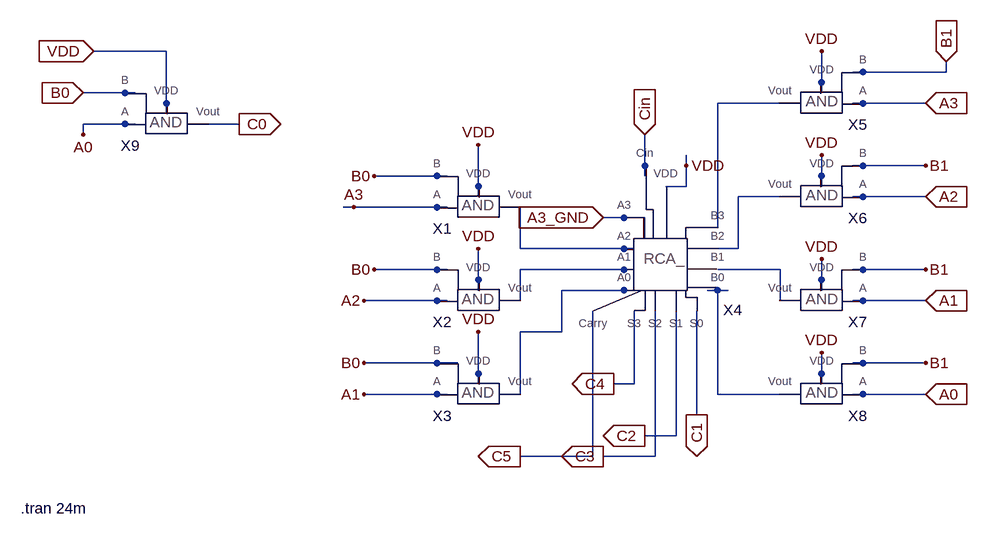
[diagram p0: schematic Mult_4_2.asc]
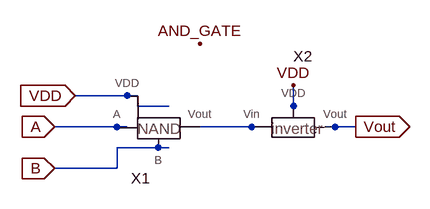
[diagram p1: sub-circuit and_gate.asc]
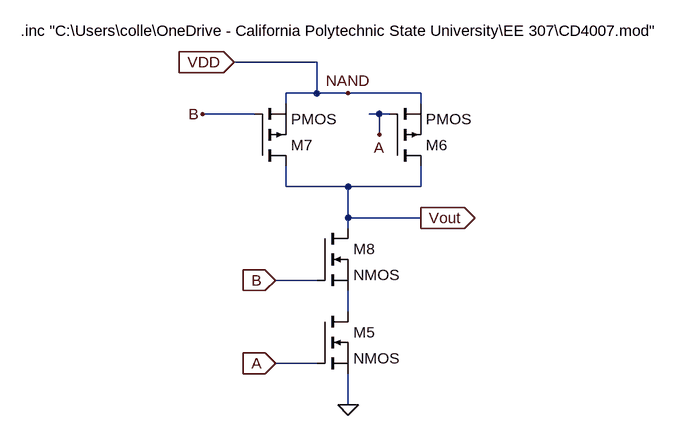
[diagram p2: sub-circuit nand_gate.asc]
Mult_4_2.asc, the LTspice schematic file:
Version 4
SHEET 1 880 680
WIRE -624 -192 -736 -192
WIRE 448 -160 432 -160
WIRE 576 -160 576 -176
WIRE 576 -160 448 -160
WIRE 384 -144 384 -192
WIRE -688 -128 -752 -128
WIRE -672 -128 -688 -128
WIRE 384 -128 384 -144
WIRE -624 -112 -624 -192
WIRE 320 -112 224 -112
WIRE 448 -112 432 -112
WIRE 544 -112 448 -112
WIRE -624 -96 -624 -112
WIRE -688 -80 -752 -80
WIRE -672 -80 -688 -80
WIRE -512 -80 -560 -80
WIRE -752 -64 -752 -80
WIRE 112 -16 112 -64
WIRE 176 -16 176 -32
WIRE 448 -16 432 -16
WIRE 544 -16 448 -16
WIRE -208 0 -304 0
WIRE -192 0 -208 0
WIRE 112 0 112 -16
WIRE 384 0 384 -32
WIRE -144 16 -144 -48
WIRE 176 16 176 -16
WIRE 176 16 144 16
WIRE 384 16 384 0
WIRE -144 32 -144 16
WIRE 320 32 256 32
WIRE 448 32 432 32
WIRE 544 32 448 32
WIRE -336 48 -352 48
WIRE -208 48 -336 48
WIRE -192 48 -208 48
WIRE 80 64 48 64
WIRE 112 64 80 64
WIRE 224 80 224 -112
WIRE 112 96 112 64
WIRE -80 112 -80 48
WIRE 80 112 -80 112
WIRE 96 112 80 112
WIRE 256 112 256 32
WIRE 256 112 224 112
WIRE -208 144 -304 144
WIRE -192 144 -208 144
WIRE 80 144 -80 144
WIRE 96 144 80 144
WIRE 320 144 224 144
WIRE 448 144 432 144
WIRE 544 144 448 144
WIRE -144 160 -144 112
WIRE 384 160 384 128
WIRE -144 176 -144 160
WIRE 80 176 -16 176
WIRE 96 176 80 176
WIRE 224 176 208 176
WIRE 240 176 224 176
WIRE 384 176 384 160
WIRE -208 192 -320 192
WIRE -192 192 -208 192
WIRE -80 192 -80 144
WIRE 320 192 320 144
WIRE 448 192 432 192
WIRE 544 192 448 192
WIRE -16 240 -16 176
WIRE -16 240 -80 240
WIRE -208 288 -320 288
WIRE -176 288 -208 288
WIRE 448 288 432 288
WIRE 544 288 448 288
WIRE -144 304 -144 240
WIRE 384 304 384 272
WIRE -144 320 -144 304
WIRE 96 320 96 208
WIRE 96 320 64 320
WIRE 384 320 384 304
WIRE -208 336 -320 336
WIRE -192 336 -208 336
WIRE -80 336 -80 240
WIRE 224 336 224 176
WIRE 320 336 224 336
WIRE 448 336 432 336
WIRE 544 336 448 336
WIRE 192 368 192 208
WIRE 160 400 160 208
WIRE 160 400 112 400
WIRE 32 432 32 208
WIRE 32 432 -80 432
WIRE 128 432 128 208
WIRE 128 432 48 432
FLAG 192 368 C1
IOPIN 192 368 Out
FLAG -304 0 B0
FLAG -304 144 B0
FLAG 544 336 A0
IOPIN 544 336 In
FLAG 544 192 A1
IOPIN 544 192 In
FLAG 544 32 A2
IOPIN 544 32 In
FLAG 544 -112 A3
IOPIN 544 -112 In
FLAG 576 -176 B1
IOPIN 576 -176 In
FLAG 544 -16 B1
FLAG 544 288 B1
FLAG 544 144 B1
FLAG 176 -16 VDD
FLAG 384 -192 VDD
FLAG 384 -32 VDD
FLAG 384 128 VDD
FLAG 384 272 VDD
FLAG -320 192 A2
FLAG -320 336 A1
FLAG -336 48 A3
FLAG 112 -64 Cin
IOPIN 112 -64 In
FLAG 48 64 A3_GND
IOPIN 48 64 In
FLAG -144 -48 VDD
FLAG -144 112 VDD
FLAG -144 240 VDD
FLAG -512 -80 C0
IOPIN -512 -80 Out
FLAG -752 -128 B0
IOPIN -752 -128 In
FLAG -752 -64 A0
FLAG -736 -192 VDD
IOPIN -736 -192 In
FLAG 112 400 C2
IOPIN 112 400 Out
FLAG 48 432 C3
IOPIN 48 432 Out
FLAG -80 432 C5
IOPIN -80 432 Out
FLAG 64 320 C4
IOPIN 64 320 Out
FLAG -320 288 B0
SYMBOL AND_gate -112 48 R0
SYMATTR InstName X1
SYMBOL AND_gate -112 192 R0
SYMATTR InstName X2
SYMBOL AND_gate -112 336 R0
SYMATTR InstName X3
SYMBOL RCA_ 128 176 R0
SYMATTR InstName X4
SYMBOL AND_gate 352 -112 M0
SYMATTR InstName X5
SYMBOL AND_gate 352 32 M0
SYMATTR InstName X6
SYMBOL AND_gate 352 192 M0
SYMATTR InstName X7
SYMBOL AND_gate 352 336 M0
SYMATTR InstName X8
SYMBOL AND_gate -592 -80 R0
SYMATTR InstName X9
TEXT -848 512 Left 2 !.tran 24m

and_gate.asc, the sub-circuit schematic file:
Version 4
SHEET 1 880 680
WIRE 80 128 -16 128
WIRE 80 144 80 128
WIRE 128 144 80 144
WIRE 320 144 320 112
WIRE 320 160 320 144
WIRE 64 176 -48 176
WIRE 192 176 176 176
WIRE 256 176 192 176
WIRE 272 176 256 176
WIRE 384 176 368 176
WIRE 416 176 384 176
WIRE 128 208 48 208
WIRE 48 240 48 208
WIRE 48 240 -48 240
FLAG -16 128 VDD
IOPIN -16 128 In
FLAG -48 176 A
IOPIN -48 176 In
FLAG -48 240 B
IOPIN -48 240 In
FLAG 416 176 Vout
IOPIN 416 176 Out
FLAG 320 112 VDD
FLAG 176 48 AND_GATE
SYMBOL Nand_gate 160 192 R0
SYMATTR InstName X1
SYMBOL Inverter 352 192 R0
SYMATTR InstName X2

nand_gate.asc, the sub-circuit schematic file:
Version 4
SHEET 1 880 680
WIRE -224 -192 -352 -192
WIRE -224 -144 -224 -192
WIRE -224 -144 -272 -144
WIRE -176 -144 -224 -144
WIRE -64 -144 -176 -144
WIRE -272 -128 -272 -144
WIRE -64 -128 -64 -144
WIRE -320 -112 -400 -112
WIRE -128 -112 -144 -112
WIRE -112 -112 -128 -112
WIRE -128 -80 -128 -112
WIRE -272 0 -272 -32
WIRE -176 0 -272 0
WIRE -64 0 -64 -32
WIRE -64 0 -176 0
WIRE -176 48 -176 0
WIRE -64 48 -176 48
WIRE -176 64 -176 48
WIRE -224 144 -288 144
WIRE -176 192 -176 160
WIRE -224 272 -288 272
WIRE -176 336 -176 288
FLAG -176 -144 NAND
FLAG -176 336 0
FLAG -288 272 A
IOPIN -288 272 In
FLAG -128 -80 A
FLAG -400 -112 B
FLAG -288 144 B
IOPIN -288 144 In
FLAG -64 48 Vout
IOPIN -64 48 Out
FLAG -352 -192 VDD
IOPIN -352 -192 In
SYMBOL nmos -224 192 R0
SYMATTR InstName M5
SYMBOL pmos -112 -32 M180
SYMATTR InstName M6
SYMBOL pmos -320 -32 M180
SYMATTR InstName M7
SYMBOL nmos -224 64 R0
SYMATTR InstName M8
TEXT -680 -240 Left 2 !.inc "C:\\Users\\colle\\OneDrive - California Polytechnic State University\\EE 307\\CD4007.mod"

The netlist it stands for:
* Mult_4_2.asc
XX1 A3 VDD N003 B0 and_gate
XX2 A2 VDD N004 B0 and_gate
XX3 A1 VDD N006 B0 and_gate
XX4 A3_GND N003 N004 N006 C4 C3 C2 C1 C5 N001 N002 VDD N005 N007 Cin RCA_  ; pins A3 A2 A1 A0 S3 S2 S1 S0 Carry B3 B2 VDD B1 B0 Cin
XX5 A3 VDD N001 B1 and_gate
XX6 A2 VDD N002 B1 and_gate
XX7 A1 VDD N005 B1 and_gate
XX8 A0 VDD N007 B1 and_gate
XX9 A0 VDD C0 B0 and_gate

* block symbol definitions
.subckt and_gate A VDD Vout B
XX1 A B N001 VDD nand_gate
XX2 N001 VDD Vout Inverter  ; pins Vin VDD Vout
.ends and_gate

.subckt nand_gate A B Vout VDD
M5 N001 A 0 0 NMOS
M6 Vout A VDD VDD PMOS
M7 Vout B VDD VDD PMOS
M8 Vout B N001 N001 NMOS
.inc "C:\Users\colle\OneDrive - California Polytechnic State University\EE 307\CD4007.mod"
.ends nand_gate

.model NMOS NMOS
.model PMOS PMOS
.lib standard.mos
.tran 24m
.backanno
.end